# EAGLE design sonic_beacon (EAGLE 7.5.0)
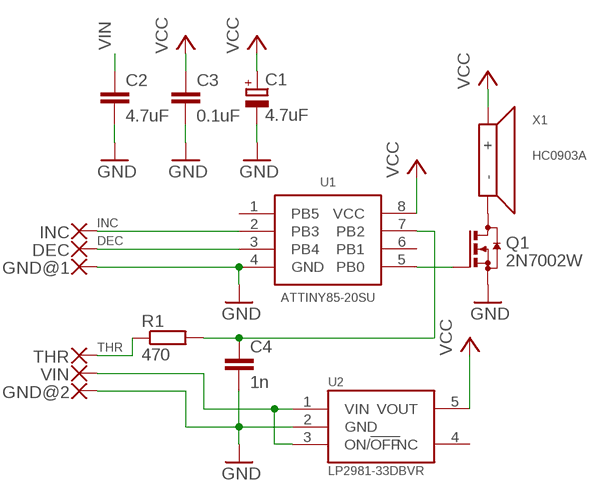
[diagram p0: schematic, sheet 1]

## Parts
C1  4.7uF  C_TANT  [A/3216-18W]
C2  4.7uF  C_CER  [C0805K]
C3  0.1uF  C_CER  [C0805K]
C4  1n  C_CER  [C0805K]
DEC  WIREPAD  [PAD]
GND@1  WIREPAD  [PAD]
GND@2  WIREPAD  [PAD]
INC  WIREPAD  [PAD]
Q1  2N7002W  [SC-70]
R1  470  R  [R0805W]
THR  WIREPAD  [PAD]
U1  ATTINY85-20SU  [8S2]
U2  LP2981-33DBVR  [SOT-23]
VIN  WIREPAD  [PAD]
X1  HC0903A  [HC0903A]

## Nets
DEC: DEC.P$1(P) U1.3(PB4)
GND: C1.- C2.2 C3.2 C4.2 GND@1.P$1(P) GND@2.P$1(P) Q1.2(S) U1.4(GND) U2.2(GND)
INC: INC.P$1(P) U1.2(PB3)
N$1: Q1.1(G) U1.5(PB0)
N$2: Q1.3(D) X1.2(-)
N$3: U2.1(VIN) U2.3(ON/!OFF) VIN.P$1(P)
N$4: C4.1 R1.2 U1.7(PB2)
THR: R1.1 THR.P$1(P)
VCC: C1.+ C3.1 U1.8(VCC) U2.5(VOUT) X1.1(+)
VIN: C2.1
Unconnected: U1.1(PB5) U1.6(PB1) U2.4(NC)

## Library data of the parts
C1 = sonic_beacon:C_TANT
C2-C4 = sonic_beacon:C_CER
DEC GND@1 GND@2 INC THR VIN = sonic_beacon:WIREPAD
Q1 = sonic_beacon:2N7002W: 2N7002W Small Signal MOSFET 60 V, 340 mA, Single, N−Channel, SC−70 ON Semiconductor
R1 = sonic_beacon:R
U1 = sonic_beacon:ATTINY85-20SU
U2 = sonic_beacon:LP2981-33DBVR
X1 = sonic_beacon:HC0903A: HC0903A SoniCrest Electro-Magnetic Sound Generators by JL World

## Board
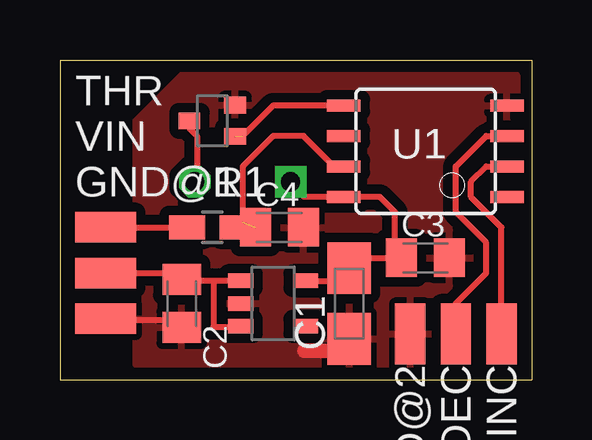
[diagram p1: board, top side]
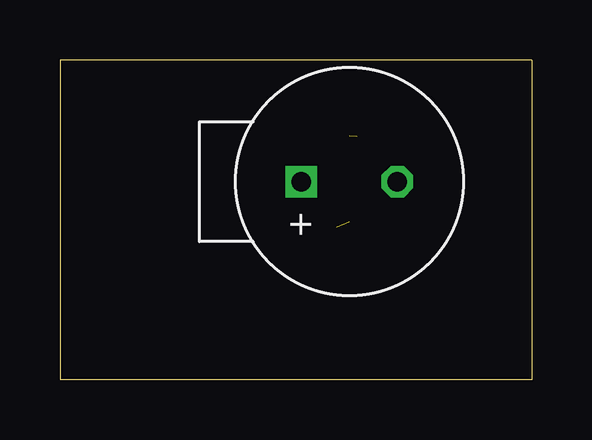
[diagram p2: board, bottom side, seen from below]

Size 19.68 x 13.34 mm. Coordinates in mm from the lower left corner, seen from the top.
Outline: 0,0 19.68,0 19.68,13.34 0,13.34 0,0
Copper layers (1*16): Top 0.035mm / dielectric 1.5mm / Bottom 0.035mm
Design rules "SeeedStudio_2layer_DRU_no_angle_20140221": minimum track width 6mil, minimum drill 12mil, track to track 6mil, track to pad 6mil, pad to pad 6mil, via to via 6mil, smd to smd 0mil, copper to edge 10mil, drill to drill 10mil, minimum pad ring 10mil, minimum via ring 6mil, stop-mask expansion 2mil, vias tented up to drill 100mil, thermal gap 10mil

### Footprints (pad centres in the part's own frame; a part is rotated, then mirrored left to right if it is on the bottom)
A/3216-18W = smd 2.15 x 1.8: + 1.475,0; - -1.475,0
C0805K = smd 1.3 x 1.6: 1 -1,0; 2 1,0
PAD = smd 2.54 x 1.27: P$1 0,0
SC-70 = smd 0.7 x 0.9: 1 -0.65,-0.95; 2 0.65,-0.95; 3 0,0.95
R0805W = smd 1.5 x 1: 1 -1.052,0; 2 1.052,0
8S2 = smd 0.5 x 1.4: 1 -1.905,-3.404; 2 -0.645,-3.404; 3 0.625,-3.404; 4 1.895,-3.404; 5 1.905,3.404; 6 0.635,3.404; 7 -0.635,3.404; 8 -1.905,3.404
SOT-23 = smd 0.6 x 1.05: 1 -0.95,-1.35; 2 0,-1.35; 3 0.95,-1.35; 4 0.95,1.35; 5 -0.95,1.35
HC0903A = drill 0.8 square: 1 0,2 | drill 0.8 octagon: 2 0,-2

### Placement (x,y rotation side)
C1  12.06,3.17 90 top
C2  5.08,3.17 270 top
C3  15.24,5.08 0 top
C4  9.15,6.35 0 top
DEC  16.51,1.91 90 top
GND@1  1.91,2.54 0 top
GND@2  14.61,1.91 90 top
INC  18.41,1.91 90 top
Q1  6.35,10.79 90 top
R1  6.35,6.35 0 top
THR  1.91,6.35 0 top
U1  15.24,9.53 90 top
U2  8.89,3.17 270 top
VIN  1.91,4.45 0 top
X1  7.62,8.26 90 bottom

### Tracks (layer width: path | path; a pad name or v marks a point on that pad's centre or on a via)
DEC
  Top 0.254: DEC.P$1 16.51,3.17 17.78,4.45 17.78,5.71 16.51,6.99 16.51,8.89 17.78,10.16 U1.3
GND
  Top 0.254: 2.06,2.46 4.8,2.46 5.03,2.23 C2.2 5.26,2.23 5.41,2.23 5.41,2.21 | C1.- 12.27,1.7 12.7,1.27 | 16.51,5.08 C3.2 16.24,5.35 | Q1.2 7.63,11.45
  Top 0.6: C1.- 11.5,1.2 10.2,1.2
  pour Top (isolate 0.4): 3.17,0.64 3.17,10.79 5.08,12.7 19.05,12.7 19.05,0.64
INC
  Top 0.254: INC.P$1 18.41,6.35 17.14,7.62 17.14,8.26 17.78,8.89 U1.2
N$1  (1 unrouted)
  Top 0.254: U1.5 8.89,11.43 7.62,10.16
N$2
  Top 0.254: Q1.3 5.4,10.47 5.71,10.16 5.71,8.35 X1.2
N$3
  Top 0.254: VIN.P$1 5.2,4.45 5.2,4.12 | 5.2,4.12 U2.1 6.4,4.12 6.4,2.2 7.54,2.2 U2.3 | 5.2,4.12 5.2,4.1
N$4  (1 unrouted)
  Top 0.254: U1.7 11.43,8.89 10.16,10.16 8.89,10.16 7.62,8.89 7.62,6.57 R1.2
THR
  Top 0.254: THR.P$1 R1.1
VCC
  Top 0.254: U2.5 11.54,4.12 C1.+ 12.27,4.65 12.7,5.08 13.97,5.08 | C3.1 13.97,5.08 | 13.97,5.08 13.97,6.99 13.34,7.62 U1.8 10.16,7.62 10.16,7.71 X1.1
VIN
  Top 0.254: C2.1 5.08,4.45